# Altium schematic sheet CPU_DDR.SchDoc
size 594 x 420 mm; SheetNumber: 3; SheetTotal: 16
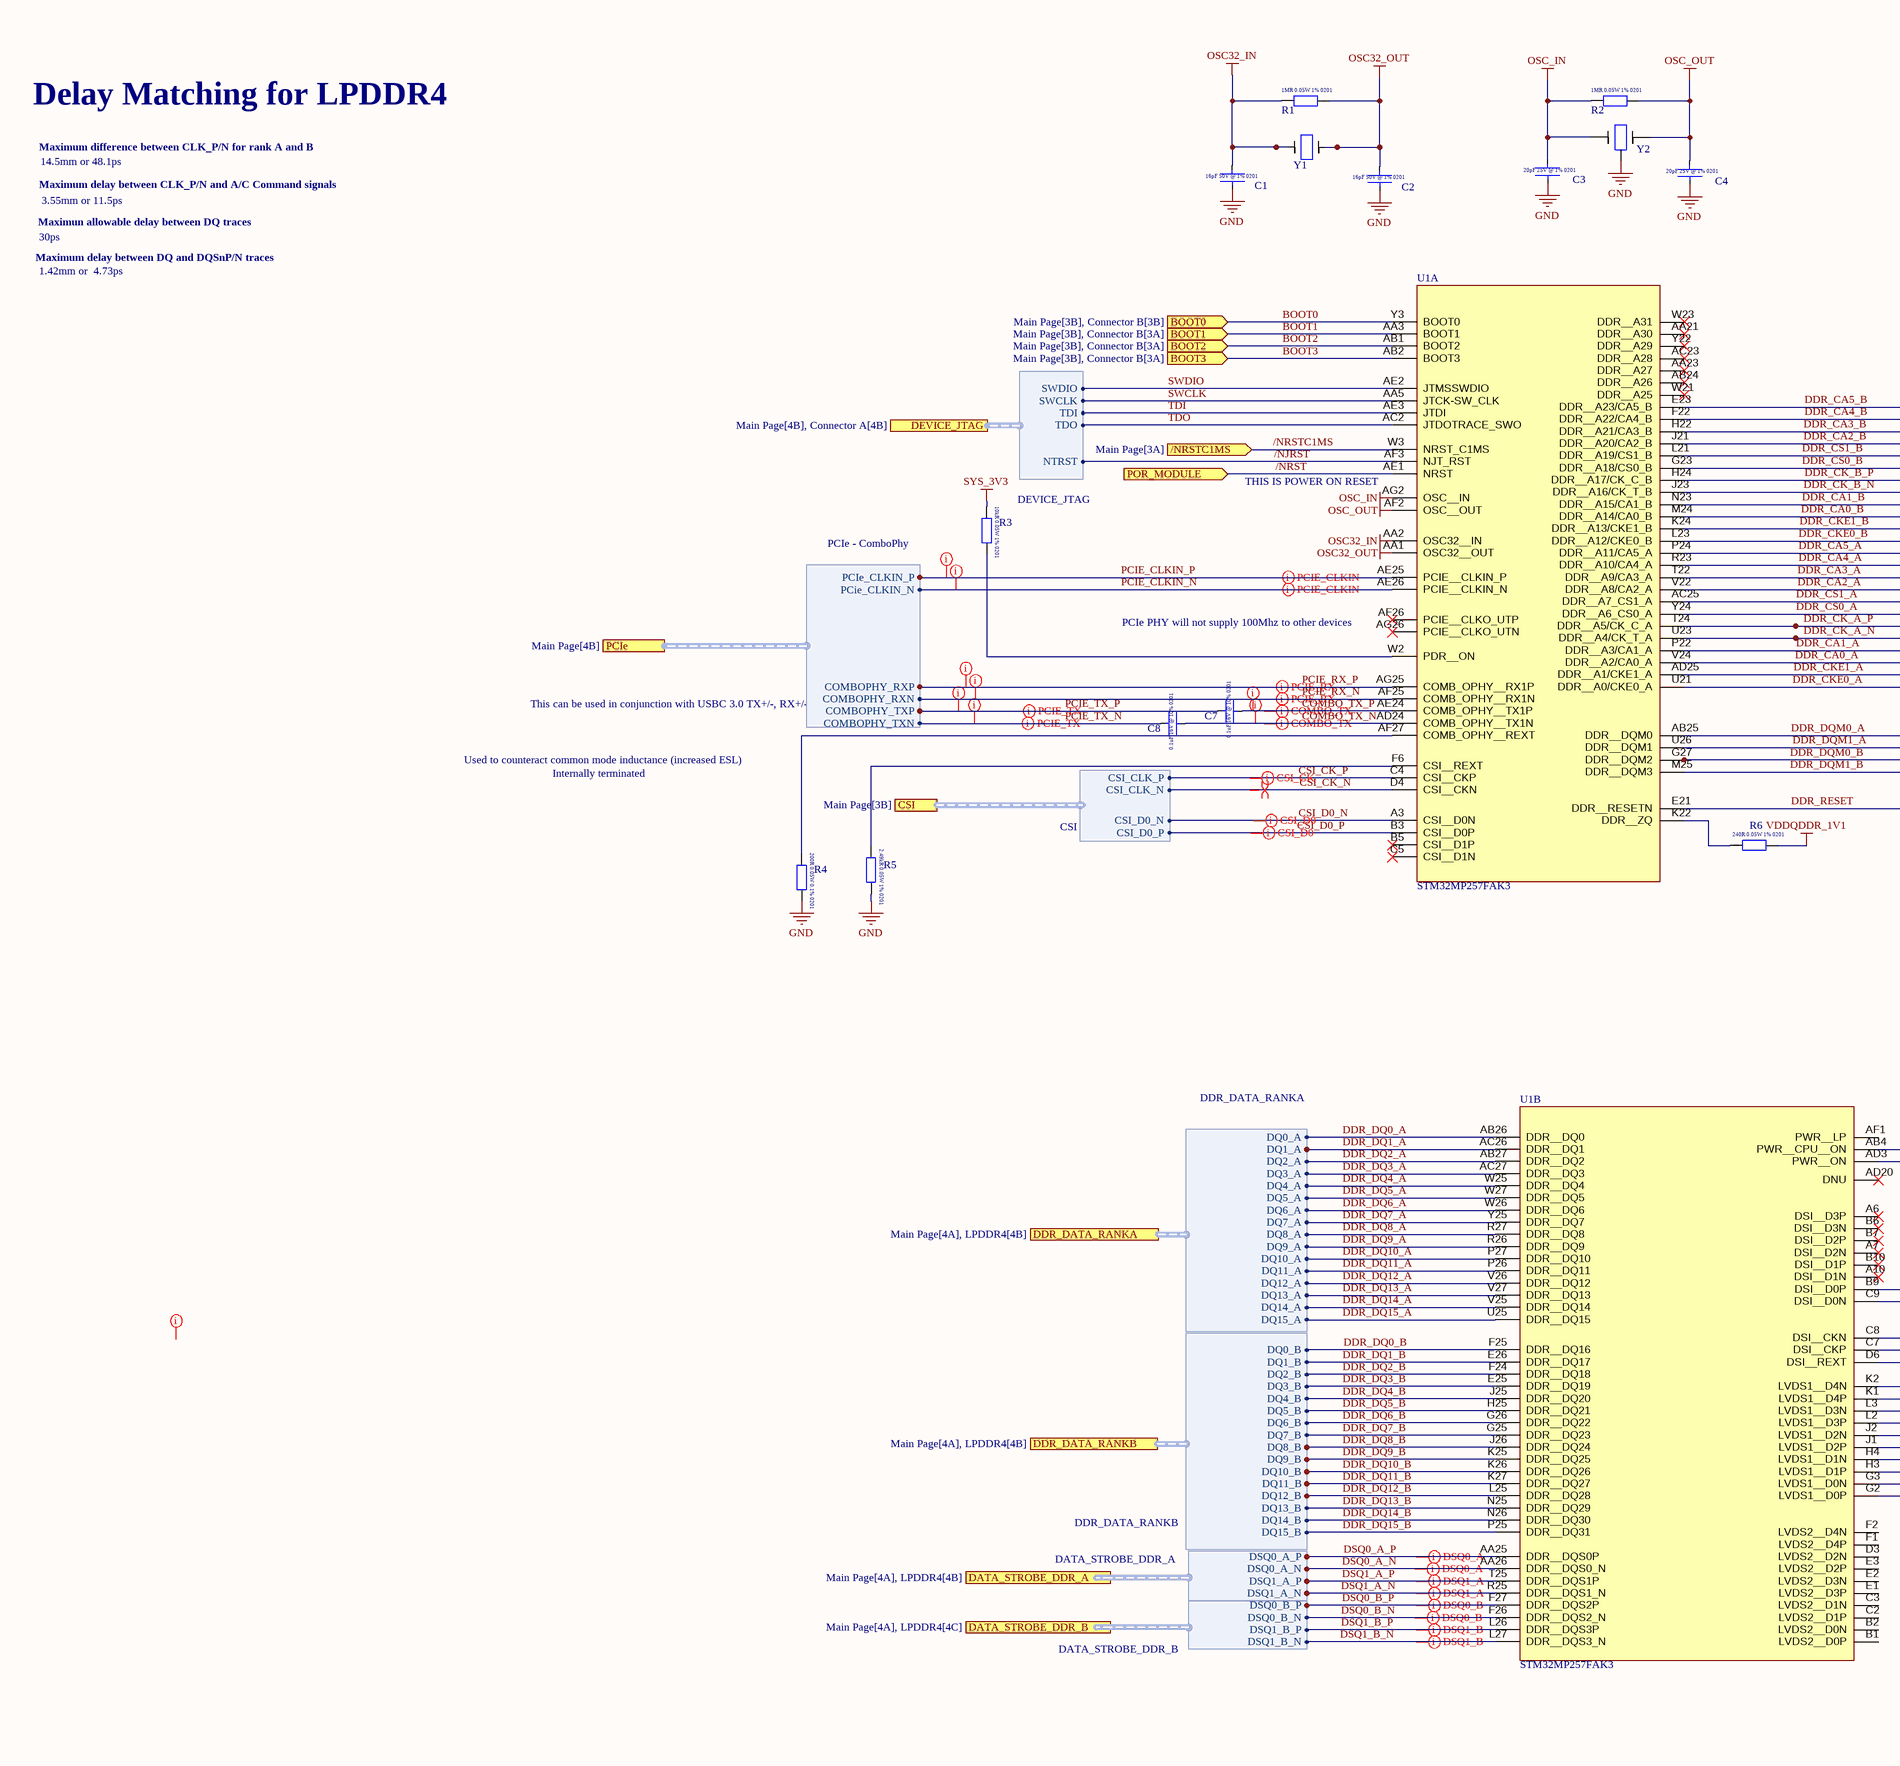
[diagram p0: CPU_DDR.SchDoc, left]
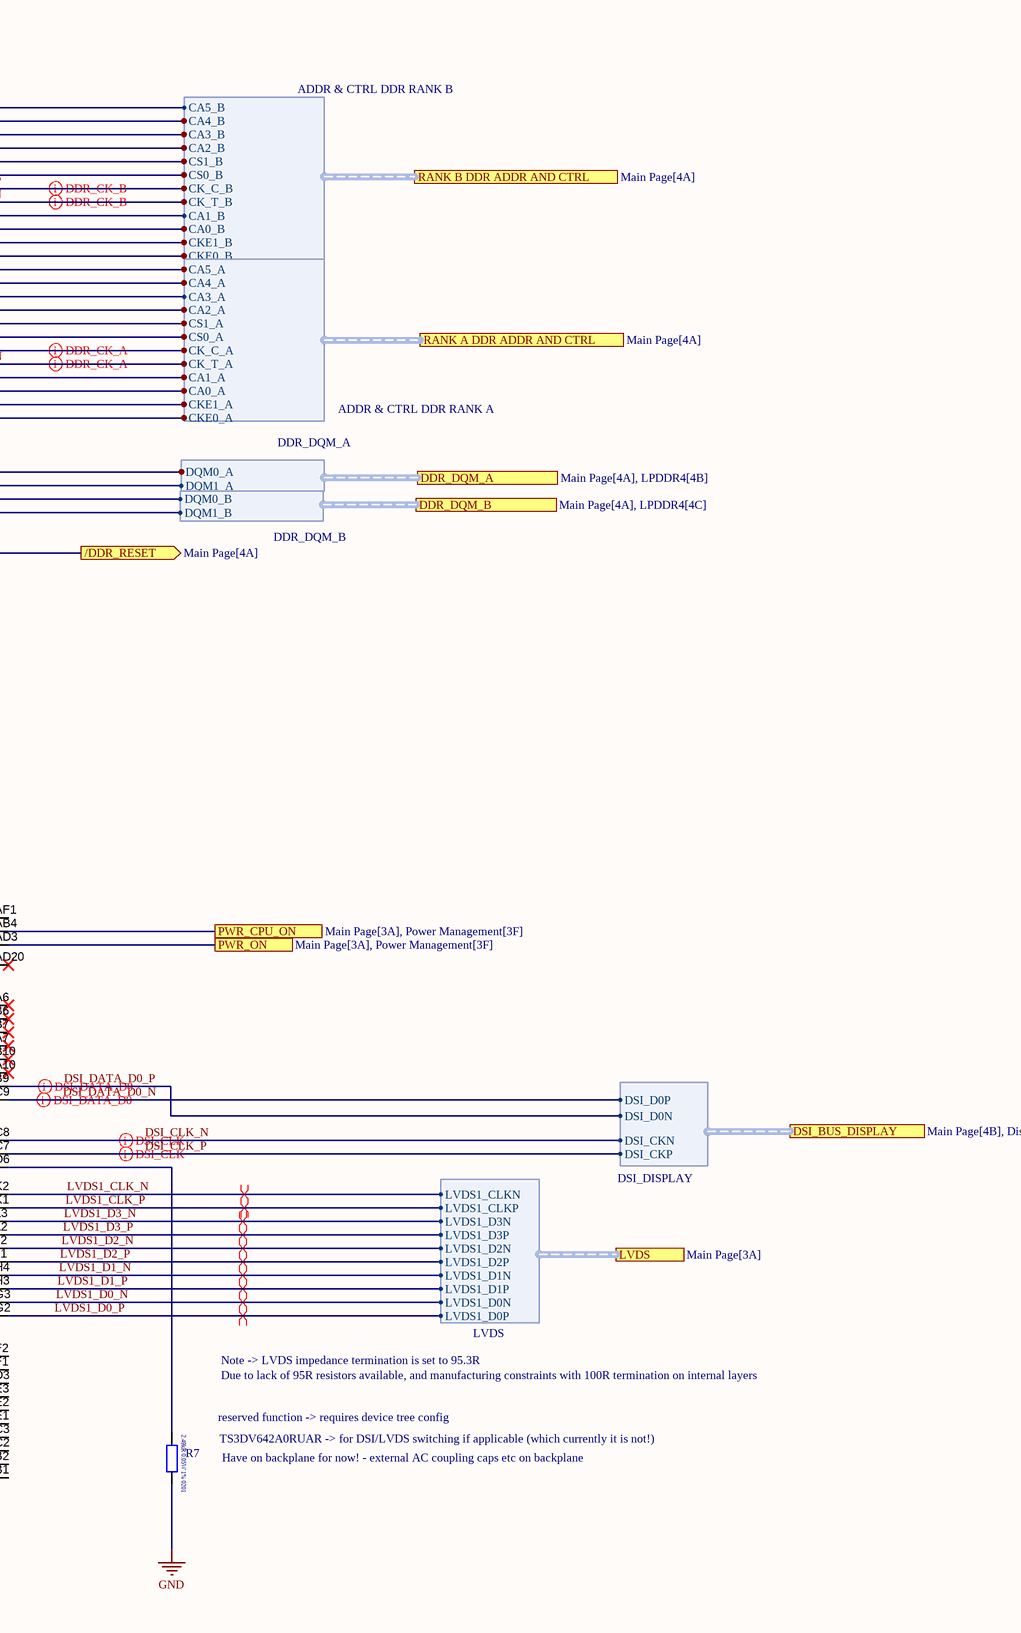
[diagram p1: CPU_DDR.SchDoc, right]

## Parts
C1  GCM0335C1H160FA16D  [CAPC0603X03L]  (value not drawn)
C2  GCM0335C1H160FA16D  [CAPC0603X03L]  (value not drawn)
C3  GJM0335C1E200FB01D  [RESC0603X03L]  (value not drawn)
C4  GJM0335C1E200FB01D  [RESC0603X03L]  (value not drawn)
C7  0.1uF  [CAPC0603X03L]  (value not drawn)
C8  0.1uF  [CAPC0603X03L]  (value not drawn)
R1  ERJ-1GNF1004C  [RESC0603X03N]  (value not drawn)
R2  ERJ-1GNF1004C  [RESC0603X03N]  (value not drawn)
R3  ERJ-1GNF1002C  [RESC0603X03L]  (value not drawn)
R4  ERA-1AEB201C  [RESC0603X03L]  (value not drawn)
R5  ERJ-1GNF2491C  [RESC0603X03L]  (value not drawn)
R6  ERJ-1GNF2400C  [RESC0603X03L]  (value not drawn)
R7  ERJ-1GNF2491C  [RESC0603X03L]  (value not drawn)
U1  STM32MP257FAK3  [STM32MP257FAK3]  (parts A,B of 7)
Y1  CM9V-T1A-32.768KHZ-12.5PF-20PPM-TA-QC  [XTAL_CM9V-T1A-32.768KHZ-12.5PF-20PPM-TA-QC]  (value not drawn)
Y2  FW400WFMT1  [FW400WFMT1]  (value not drawn)

## Ports
/DDR_RESET (out, see Main Page[4A]), /NRSTC1MS (in, see Main Page[3A]), BOOT0 (in, see Main Page[3B], Connector B[3B]), BOOT1 (in, see Main Page[3B], Connector B[3A]), BOOT2 (in, see Main Page[3B], Connector B[3A]), BOOT3 (in, see Main Page[3B], Connector B[3A]), CSI (harness CSI, see Main Page[3B]), DATA_STROBE_DDR_A (harness DATA_STROBE_DDR_A, see Main Page[4A], LPDDR4[4B]), DATA_STROBE_DDR_B (harness DATA_STROBE_DDR_B, see Main Page[4A], LPDDR4[4C]), DDR_DATA_RANKA (harness DDR_DATA_RANKA, see Main Page[4A], LPDDR4[4B]), DDR_DATA_RANKB (harness DDR_DATA_RANKB, see Main Page[4A], LPDDR4[4B]), DDR_DQM_A (harness DDR_DQM_A, see Main Page[4A], LPDDR4[4B]), DDR_DQM_B (harness DDR_DQM_B, see Main Page[4A], LPDDR4[4C]), DEVICE_JTAG (harness DEVICE_JTAG, see Main Page[4B], Connector A[4B]), DSI_BUS_DISPLAY (harness DSI_DISPLAY, see Main Page[4B], Display[1B]), LVDS (harness LVDS, see Main Page[3A]), PCIe (harness PCIe - ComboPhy, see Main Page[4B]), POR_MODULE (in, see Main Page[3A], Connector B[1D], Power Management[3F]), PWR_CPU_ON (see Main Page[3A], Power Management[3F]), PWR_ON (see Main Page[3A], Power Management[3F]), RANK A DDR ADDR AND CTRL (harness ADDR & CTRL DDR RANK A, see Main Page[4A]), RANK B DDR ADDR AND CTRL (harness ADDR & CTRL DDR RANK B, see Main Page[4A])

## Harnesses
ADDR & CTRL DDR RANK B: CA5_B, CA4_B, CA3_B, CA2_B, CS1_B, CS0_B, CK_C_B, CK_T_B, CA1_B, CA0_B, CKE1_B, CKE0_B
ADDR & CTRL DDR RANK A: CA5_A, CA4_A, CA3_A, CA2_A, CS1_A, CS0_A, CK_C_A, CK_T_A, CA1_A, CA0_A, CKE1_A, CKE0_A
DDR_DQM_A: DQM0_A, DQM1_A
DDR_DATA_RANKA: DQ0_A, DQ1_A, DQ2_A, DQ3_A, DQ4_A, DQ5_A, DQ6_A, DQ7_A, DQ8_A, DQ9_A, DQ10_A, DQ11_A, DQ12_A, DQ13_A, DQ14_A, DQ15_A
DDR_DATA_RANKB: DQ0_B, DQ1_B, DQ2_B, DQ3_B, DQ4_B, DQ5_B, DQ6_B, DQ7_B, DQ8_B, DQ9_B, DQ10_B, DQ11_B, DQ12_B, DQ13_B, DQ14_B, DQ15_B
DSI_DISPLAY: DSI_D0P, DSI_D0N, DSI_CKN, DSI_CKP
PCIe - ComboPhy: PCIe_CLKIN_P, PCie_CLKIN_N, COMBOPHY_RXP, COMBOPHY_RXN, COMBOPHY_TXP, COMBOPHY_TXN
DEVICE_JTAG: SWDIO, SWCLK, TDI, TDO, NTRST
LVDS: LVDS1_CLKN, LVDS1_CLKP, LVDS1_D3N, LVDS1_D3P, LVDS1_D2N, LVDS1_D2P, LVDS1_D1N, LVDS1_D1P, LVDS1_D0N, LVDS1_D0P
DDR_DQM_B: DQM0_B, DQM1_B
DATA_STROBE_DDR_A: DSQ0_A_P, DSQ0_A_N, DSQ1_A_P, DSQ1_A_N
DATA_STROBE_DDR_B: DSQ0_B_P, DSQ0_B_N, DSQ1_B_P, DSQ1_B_N
CSI: CSI_CLK_N, CSI_CLK_P, CSI_D0_N, CSI_D0_P

## Nets
GND: C1.1 C2.1 C3.1 C4.1 R4.2 R5.2 R7.2 Y2.4,2
OSC32_IN: C1.2 R1.1 U1.AA2(OSC32__IN) Y1.1
OSC32_OUT: C2.2 R1.2 U1.AA1(OSC32__OUT) Y1.2
OSC_IN: C3.2 R2.1 U1.AG2(OSC__IN) Y2.1
OSC_OUT: C4.2 R2.2 U1.AF2(OSC__OUT) Y2.3
SYS_3V3: R3.1
VDDQDDR_1V1: R6.2
/NJRST: U1.AF3(NJT_RST) ; port DEVICE_JTAG.NTRST
/NRST: U1.AE1(NRST) ; port POR_MODULE
/NRSTC1MS: U1.W3(NRST_C1MS) ; port /NRSTC1MS
BOOT0: U1.Y3(BOOT0) ; port BOOT0
BOOT1: U1.AA3(BOOT1) ; port BOOT1
BOOT2: U1.AB1(BOOT2) ; port BOOT2
BOOT3: U1.AB2(BOOT3) ; port BOOT3
COMBO_TX_N: C8.1 U1.AD24(COMB_OPHY__TX1N)
COMBO_TX_P: C7.1 U1.AE24(COMB_OPHY__TX1P)
CSI_CK_N: U1.D4(CSI__CKN) ; port CSI.CSI_CLK_N
CSI_CK_P: U1.C4(CSI__CKP) ; port CSI.CSI_CLK_P
CSI_D0_N: U1.A3(CSI__D0N) ; port CSI.CSI_D0_N
CSI_D0_P: U1.B3(CSI__D0P) ; port CSI.CSI_D0_P
DDR_CA0_A: U1.V24(DDR__A2/CA0_A) ; port RANK A DDR ADDR AND CTRL.CA0_A
DDR_CA0_B: U1.M24(DDR__A14/CA0_B) ; port RANK B DDR ADDR AND CTRL.CA0_B
DDR_CA1_A: U1.P22(DDR__A3/CA1_A) ; port RANK A DDR ADDR AND CTRL.CA1_A
DDR_CA1_B: U1.N23(DDR__A15/CA1_B) ; port RANK B DDR ADDR AND CTRL.CA1_B
DDR_CA2_A: U1.V22(DDR__A8/CA2_A) ; port RANK A DDR ADDR AND CTRL.CA2_A
DDR_CA2_B: U1.J21(DDR__A20/CA2_B) ; port RANK B DDR ADDR AND CTRL.CA2_B
DDR_CA3_A: U1.T22(DDR__A9/CA3_A) ; port RANK A DDR ADDR AND CTRL.CA3_A
DDR_CA3_B: U1.H22(DDR__A21/CA3_B) ; port RANK B DDR ADDR AND CTRL.CA3_B
DDR_CA4_A: U1.R23(DDR__A10/CA4_A) ; port RANK A DDR ADDR AND CTRL.CA4_A
DDR_CA4_B: U1.F22(DDR__A22/CA4_B) ; port RANK B DDR ADDR AND CTRL.CA4_B
DDR_CA5_A: U1.P24(DDR__A11/CA5_A) ; port RANK A DDR ADDR AND CTRL.CA5_A
DDR_CA5_B: U1.E23(DDR__A23/CA5_B) ; port RANK B DDR ADDR AND CTRL.CA5_B
DDR_CK_A_N: U1.U23(DDR__A4/CK_T_A) ; port RANK A DDR ADDR AND CTRL.CK_T_A
DDR_CK_A_P: U1.T24(DDR__A5/CK_C_A) ; port RANK A DDR ADDR AND CTRL.CK_C_A
DDR_CK_B_N: U1.J23(DDR__A16/CK_T_B) ; port RANK B DDR ADDR AND CTRL.CK_T_B
DDR_CK_B_P: U1.H24(DDR__A17/CK_C_B) ; port RANK B DDR ADDR AND CTRL.CK_C_B
DDR_CKE0_A: U1.U21(DDR__A0/CKE0_A) ; port RANK A DDR ADDR AND CTRL.CKE0_A
DDR_CKE0_B: U1.L23(DDR__A12/CKE0_B) ; port RANK B DDR ADDR AND CTRL.CKE0_B
DDR_CKE1_A: U1.AD25(DDR__A1/CKE1_A) ; port RANK A DDR ADDR AND CTRL.CKE1_A
DDR_CKE1_B: U1.K24(DDR__A13/CKE1_B) ; port RANK B DDR ADDR AND CTRL.CKE1_B
DDR_CS0_A: U1.Y24(DDR__A6_CS0_A) ; port RANK A DDR ADDR AND CTRL.CS0_A
DDR_CS0_B: U1.G23(DDR__A18/CS0_B) ; port RANK B DDR ADDR AND CTRL.CS0_B
DDR_CS1_A: U1.AC25(DDR__A7_CS1_A) ; port RANK A DDR ADDR AND CTRL.CS1_A
DDR_CS1_B: U1.L21(DDR__A19/CS1_B) ; port RANK B DDR ADDR AND CTRL.CS1_B
DDR_DQ0_A: U1.AB26(DDR__DQ0) ; port DDR_DATA_RANKA.DQ0_A
DDR_DQ0_B: U1.F25(DDR__DQ16) ; port DDR_DATA_RANKB.DQ0_B
DDR_DQ1_A: U1.AC26(DDR__DQ1) ; port DDR_DATA_RANKA.DQ1_A
DDR_DQ1_B: U1.E26(DDR__DQ17) ; port DDR_DATA_RANKB.DQ1_B
DDR_DQ2_A: U1.AB27(DDR__DQ2) ; port DDR_DATA_RANKA.DQ2_A
DDR_DQ2_B: U1.F24(DDR__DQ18) ; port DDR_DATA_RANKB.DQ2_B
DDR_DQ3_A: U1.AC27(DDR__DQ3) ; port DDR_DATA_RANKA.DQ3_A
DDR_DQ3_B: U1.E25(DDR__DQ19) ; port DDR_DATA_RANKB.DQ3_B
DDR_DQ4_A: U1.W25(DDR__DQ4) ; port DDR_DATA_RANKA.DQ4_A
DDR_DQ4_B: U1.J25(DDR__DQ20) ; port DDR_DATA_RANKB.DQ4_B
DDR_DQ5_A: U1.W27(DDR__DQ5) ; port DDR_DATA_RANKA.DQ5_A
DDR_DQ5_B: U1.H25(DDR__DQ21) ; port DDR_DATA_RANKB.DQ5_B
DDR_DQ6_A: U1.W26(DDR__DQ6) ; port DDR_DATA_RANKA.DQ6_A
DDR_DQ6_B: U1.G26(DDR__DQ22) ; port DDR_DATA_RANKB.DQ6_B
DDR_DQ7_A: U1.Y25(DDR__DQ7) ; port DDR_DATA_RANKA.DQ7_A
DDR_DQ7_B: U1.G25(DDR__DQ23) ; port DDR_DATA_RANKB.DQ7_B
DDR_DQ8_A: U1.R27(DDR__DQ8) ; port DDR_DATA_RANKA.DQ8_A
DDR_DQ8_B: U1.J26(DDR__DQ24) ; port DDR_DATA_RANKB.DQ8_B
DDR_DQ9_A: U1.R26(DDR__DQ9) ; port DDR_DATA_RANKA.DQ9_A
DDR_DQ9_B: U1.K25(DDR__DQ25) ; port DDR_DATA_RANKB.DQ9_B
DDR_DQ10_A: U1.P27(DDR__DQ10) ; port DDR_DATA_RANKA.DQ10_A
DDR_DQ10_B: U1.K26(DDR__DQ26) ; port DDR_DATA_RANKB.DQ10_B
DDR_DQ11_A: U1.P26(DDR__DQ11) ; port DDR_DATA_RANKA.DQ11_A
DDR_DQ11_B: U1.K27(DDR__DQ27) ; port DDR_DATA_RANKB.DQ11_B
DDR_DQ12_A: U1.V26(DDR__DQ12) ; port DDR_DATA_RANKA.DQ12_A
DDR_DQ12_B: U1.L25(DDR__DQ28) ; port DDR_DATA_RANKB.DQ12_B
DDR_DQ13_A: U1.V27(DDR__DQ13) ; port DDR_DATA_RANKA.DQ13_A
DDR_DQ13_B: U1.N25(DDR__DQ29) ; port DDR_DATA_RANKB.DQ13_B
DDR_DQ14_A: U1.V25(DDR__DQ14) ; port DDR_DATA_RANKA.DQ14_A
DDR_DQ14_B: U1.N26(DDR__DQ30) ; port DDR_DATA_RANKB.DQ14_B
DDR_DQ15_A: U1.U25(DDR__DQ15) ; port DDR_DATA_RANKA.DQ15_A
DDR_DQ15_B: U1.P25(DDR__DQ31) ; port DDR_DATA_RANKB.DQ15_B
DDR_DQM0_A: U1.AB25(DDR__DQM0) ; port DDR_DQM_A.DQM0_A
DDR_DQM0_B: U1.G27(DDR__DQM2) ; port DDR_DQM_B.DQM0_B
DDR_DQM1_A: U1.U26(DDR__DQM1) ; port DDR_DQM_A.DQM1_A
DDR_DQM1_B: U1.M25(DDR__DQM3) ; port DDR_DQM_B.DQM1_B
DDR_RESET: U1.E21(DDR__RESETN) ; port /DDR_RESET
DSI_CLK_N: U1.C8(DSI__CKN) ; port DSI_BUS_DISPLAY.DSI_CKN
DSI_CLK_P: U1.C7(DSI__CKP) ; port DSI_BUS_DISPLAY.DSI_CKP
DSI_DATA_D0_N: U1.C9(DSI__D0N) ; port DSI_BUS_DISPLAY.DSI_D0P
DSI_DATA_D0_P: U1.B9(DSI__D0P) ; port DSI_BUS_DISPLAY.DSI_D0N
DSQ0_A_N: U1.AA26(DDR__DQS0_N) ; port DATA_STROBE_DDR_A.DSQ0_A_N
DSQ0_A_P: U1.AA25(DDR__DQS0P) ; port DATA_STROBE_DDR_A.DSQ0_A_P
DSQ0_B_N: U1.F26(DDR__DQS2_N) ; port DATA_STROBE_DDR_B.DSQ0_B_N
DSQ0_B_P: U1.F27(DDR__DQS2P) ; port DATA_STROBE_DDR_B.DSQ0_B_P
DSQ1_A_N: U1.R25(DDR__DQS1_N) ; port DATA_STROBE_DDR_A.DSQ1_A_N
DSQ1_A_P: U1.T25(DDR__DQS1P) ; port DATA_STROBE_DDR_A.DSQ1_A_P
DSQ1_B_N: U1.L27(DDR__DQS3_N) ; port DATA_STROBE_DDR_B.DSQ1_B_N
DSQ1_B_P: U1.L26(DDR__DQS3P) ; port DATA_STROBE_DDR_B.DSQ1_B_P
LVDS1_CLK_N: U1.K2(LVDS1__D4N) ; port LVDS.LVDS1_CLKN
LVDS1_CLK_P: U1.K1(LVDS1__D4P) ; port LVDS.LVDS1_CLKP
LVDS1_D0_N: U1.G3(LVDS1__D0N) ; port LVDS.LVDS1_D0N
LVDS1_D0_P: U1.G2(LVDS1__D0P) ; port LVDS.LVDS1_D0P
LVDS1_D1_N: U1.H4(LVDS1__D1N) ; port LVDS.LVDS1_D1N
LVDS1_D1_P: U1.H3(LVDS1__D1P) ; port LVDS.LVDS1_D1P
LVDS1_D2_N: U1.J2(LVDS1__D2N) ; port LVDS.LVDS1_D2N
LVDS1_D2_P: U1.J1(LVDS1__D2P) ; port LVDS.LVDS1_D2P
LVDS1_D3_N: U1.L3(LVDS1__D3N) ; port LVDS.LVDS1_D3N
LVDS1_D3_P: U1.L2(LVDS1__D3P) ; port LVDS.LVDS1_D3P
PCIE_CLKIN_N: U1.AE26(PCIE__CLKIN_N) ; port PCIe.PCie_CLKIN_N
PCIE_CLKIN_P: U1.AE25(PCIE__CLKIN_P) ; port PCIe.PCIe_CLKIN_P
PCIE_RX_N: U1.AF25(COMB_OPHY__RX1N) ; port PCIe.COMBOPHY_RXN
PCIE_RX_P: U1.AG25(COMB_OPHY__RX1P) ; port PCIe.COMBOPHY_RXP
PCIE_TX_N: C8.2 ; port PCIe.COMBOPHY_TXN
PCIE_TX_P: C7.2 ; port PCIe.COMBOPHY_TXP
PWR_CPU_ON: U1.AB4(PWR__CPU__ON) ; port PWR_CPU_ON
PWR_ON: U1.AD3(PWR__ON) ; port PWR_ON
SWCLK: U1.AA5(JTCK-SW_CLK) ; port DEVICE_JTAG.SWCLK
SWDIO: U1.AE2(JTMSSWDIO) ; port DEVICE_JTAG.SWDIO
TDI: U1.AE3(JTDI) ; port DEVICE_JTAG.TDI
TDO: U1.AC2(JTDOTRACE_SWO) ; port DEVICE_JTAG.TDO
NetR3_2: R3.2 U1.W2(PDR__ON)
NetR4_1: R4.1 U1.AF27(COMB_OPHY__REXT)
NetR5_1: R5.1 U1.F6(CSI__REXT)
NetR6_1: R6.1 U1.K22(DDR__ZQ)
NetR7_1: R7.1 U1.D6(DSI__REXT)

Not connected (* = marked no-connect by the designer): U1 A6(DSI__D3P)* A7(DSI__D2N)* A10(DSI__D1N)* AA21(DDR__A30)* AA23(DDR__A27)* AB24(DDR__A26)* AC23(DDR__A28)* AD20(DNU)* AF1(PWR__LP) AF26(PCIE__CLKO_UTP)* AG26(PCIE__CLKO_UTN)* B1(LVDS2__D0P) B2(LVDS2__D0N) B5(CSI__D1P)* B6(DSI__D3N)* B7(DSI__D2P)* B10(DSI__D1P)* C2(LVDS2__D1P) C3(LVDS2__D1N) C5(CSI__D1N)* D3(LVDS2__D2N) E1(LVDS2__D3P) E2(LVDS2__D3N) E3(LVDS2__D2P) F1(LVDS2__D4P) F2(LVDS2__D4N) W21(DDR__A25)* W23(DDR__A31)* Y22(DDR__A29)*

## Layout directives
differential pair: COMBO_TX_N, COMBO_TX_P, CSI_CK_N, CSI_CK_P, CSI_D0_N, CSI_D0_P, DDR_CK_A_N, DDR_CK_A_P, DDR_CK_B_N, DDR_CK_B_P, DSI_CLK_N, DSI_CLK_P, DSI_DATA_D0_N, DSI_DATA_D0_P, DSQ0_A_N, DSQ0_A_P, DSQ0_B_N, DSQ0_B_P, DSQ1_A_N, DSQ1_A_P, DSQ1_B_N, DSQ1_B_P, LVDS1_CLK_N, LVDS1_CLK_P, LVDS1_D0_N, LVDS1_D0_P, LVDS1_D1_N, LVDS1_D1_P, LVDS1_D2_N, LVDS1_D2_P, LVDS1_D3_N, LVDS1_D3_P, PCIE_CLKIN_N, PCIE_CLKIN_P, PCIE_RX_N, PCIE_RX_P, PCIE_TX_N, PCIE_TX_P
net class High Speed Digital: (no net found under the mark), COMBO_TX_N, COMBO_TX_P, PCIE_CLKIN_N, PCIE_CLKIN_P, PCIE_RX_N, PCIE_RX_P, PCIE_TX_N, PCIE_TX_P

## Notes on the sheet
- Delay Matching for LPDDR4
- Maximum difference between CLK_P/N for rank A and B
- Maximum delay between CLK_P/N and A/C Command signals
- 14.5mm or 48.1ps
- Maximun allowable delay between DQ traces
- 30ps
- 3.55mm or 11.5ps
- Maximum delay between DQ and DQSnP/N traces
- 1.42mm or  4.73ps
- THIS IS POWER ON RESET
- (near U1) PCIe PHY will not supply 100Mhz to other devices
- This can be used in conjunction with USBC 3.0 TX+/-, RX+/-
- Used to counteract common mode inductance (increased ESL)
- Internally terminated
- (near U1) Figure out the PWR_LP situation out
- (near U1) 2.5Gbit each channel
- (near R7) reserved function -> requires device tree config
- Note -> LVDS impedance termination is set to 95.3R
- Due to lack of 95R resistors available, and manufacturing constraints with 100R termination on internal layers
- (near R7) TS3DV642A0RUAR -> for DSI/LVDS switching if applicable (which currently it is not!)
- (near R7) Have on backplane for now! - external AC coupling caps etc on backplane
- DWG NO:
- REV:
- THIS DOCUMENT AND THE DATA DISCLOSED HEREIN OR
- HEREWITH IS THE PROPERTY OF ALTIUM LIMITED AND MAY
- BE FREELY DISTRIBUTED IN WHOLE. NO RIGHTS ARE
- RESERVED OR EXPRESS OR IMPLIED WARANTEE GIVEN.
- REVISION
- DESCRIPTION
- DATE
- APPROVED
- ENG:
- APPROVALS
- PROJECT
- DSN:
- CHK:
- REFERENCE DOCUMENTS
- PROJECT REVISION:
- TITLE
- DOCUMENT REVISION:
- DESIGN ITEM:
- BOM:
- FAB DWG:
- PCB DWG:
- ASSY DWG:
- SCALE:
- A2
- SIZE
- CAGE CODE
- FILE NAME
- DWG NO.
- SHEET
- OF
- REV
- (in symbol ERA-1AEB201C) 200R 0.05W 0.1% 0201
- (in symbol ERJ-1GNF1002C) 10kR 0.05W 1% 0201
- (in symbol ERJ-1GNF1004C) 1MR 0.05W 1% 0201
- (in symbol ERJ-1GNF2400C) 240R 0.05W 1% 0201
- (in symbol ERJ-1GNF2491C) 2.49kR 0.05W 1% 0201
- (in symbol GCM0335C1H160FA16D) 16pF 50V @ 1% 0201
- (in symbol GJM0335C1E200FB01D) 20pF 25V @ 1% 0201
- (in symbol GRM033R61E104KE14J) 0.1uF 16V @ 10% 0201

## Library data of the parts
C1 C2 = GCM0335C1H160FA16D: 16 pF ±1% 50V Ceramic Capacitor C0G, NP0 0201 (0603 Metric); ComponentLink1Description: New link; ComponentLink1URL: https://www.digikey.com.au/en/products/detail/murata-electronics/GCM0335C1H160FA16D/17844782
C3 C4 = GJM0335C1E200FB01D: 20 pF ±1% 25V Ceramic Capacitor C0G, NP0 0201 (0603 Metric); ComponentLink1Description: New link; ComponentLink1URL: https://www.digikey.com.au/en/products/detail/murata-electronics/GJM0335C1E200FB01D/10702837
C7 C8 = GRM033R61E104KE14J: 0.1 µF ±10% 25V Ceramic Capacitor X5R 0201 (0603 Metric)0.1 µF ±10% 25V Ceramic Capacitor X5R 0201 (0603 Metric); ComponentLink1Description: New link; ComponentLink1URL: https://www.digikey.com.au/en/products/detail/murata-electronics/GRM033R61E104KE14J/4904732?s=N4IgTCBcDaIOICUCyAGAzGhA2AjAURxQBYBpAogKRAF0BfIA
R1 R2 = ERJ-1GNF1004C: 1 MOhms ±1% 0.05W, 1/20W Chip Resistor 0201 (0603 Metric) Thick Film; ComponentLink1Description: New link; ComponentLink1URL: https://www.digikey.com.au/en/products/detail/panasonic-electronic-components/ERJ-1GNF1004C/2036455
R3 = ERJ-1GNF1002C: 10 kOhms ±1% 0.05W, 1/20W Chip Resistor 0201 (0603 Metric) Thick Film; ComponentLink1Description: New link; ComponentLink1URL: https://www.digikey.com.au/en/products/detail/panasonic-electronic-components/ERJ-1GNF1002C/2036226
R4 = ERA-1AEB201C: 200 Ohms ±0.1% 0.05W, 1/20W Chip Resistor 0201 (0603 Metric) Automotive AEC-Q200 Thin Film; ComponentLink1Description: New link; ComponentLink1URL: https://www.digikey.com.au/en/products/detail/panasonic-electronic-components/ERA-1AEB201C/5035575
R5 R7 = ERJ-1GNF2491C: 2.49 kOhms ±1% 0.05W, 1/20W Chip Resistor 0201 (0603 Metric) Thick Film; ComponentLink1Description: New link; ComponentLink1URL: https://www.digikey.com.au/en/products/detail/panasonic-electronic-components/ERJ-1GNF2491C/2036155
U1 = STM32MP257FAK3: Integrated Circuit; Manufacturer_Name: STMicroelectronics; Datasheet Link: https://www.digikey.ph/en/products/detail/stmicroelectronics/STM32MP257FAK3/24883094; Height: 1mm; Manufacturer_Part_Number: STM32MP257FAK3; Mouser Part Number: 511-STM32MP257FAK3; Mouser Price/Stock: https://www.mouser.co.uk/ProductDetail/STMicroelectronics/STM32MP257FAK3?qs=i8QVZAFTkqQulHX8Hxkfng%3D%3D; Arrow Part Number: STM32MP257FAK3; Arrow Price/Stock: https://www.arrow.com/en/products/stm32mp257fak3/stmicroelectronics?utm_currency=USD&region=nac; Supplier 1: Arrow Electronics; Supplier Part Number 1: STM32MP257FAK3
Y1 = CM9V-T1A-32.768KHZ-12.5PF-20PPM-TA-QC: 32.768 kHz ±20ppm Crystal 12.5pF 75 kOhms 2-SMD, No Lead; Supplier 1: Digikey; Supplier Part Number 1: 2195-CM9V-T1A-32.768KHZ-12.5PF-20PPM-TA-QCCT-ND
Y2 = FW400WFMT1: 40 MHz ±7ppm Crystal 12pF 80 Ohms 4-SMD, No Lead
R6 = ERJ-1GNF2400C: ComponentLink1Description: New link; ComponentLink1URL: https://www.digikey.com.au/en/products/detail/panasonic-electronic-components/ERJ-1GNF2400C/2036039